# EasyEDA schematic Smart_Tiestu_v3.json
TITLE: Sheet_1; REV: 1.0; Date: 2025-11-17; Sheet: 1/1; Company: Your Company
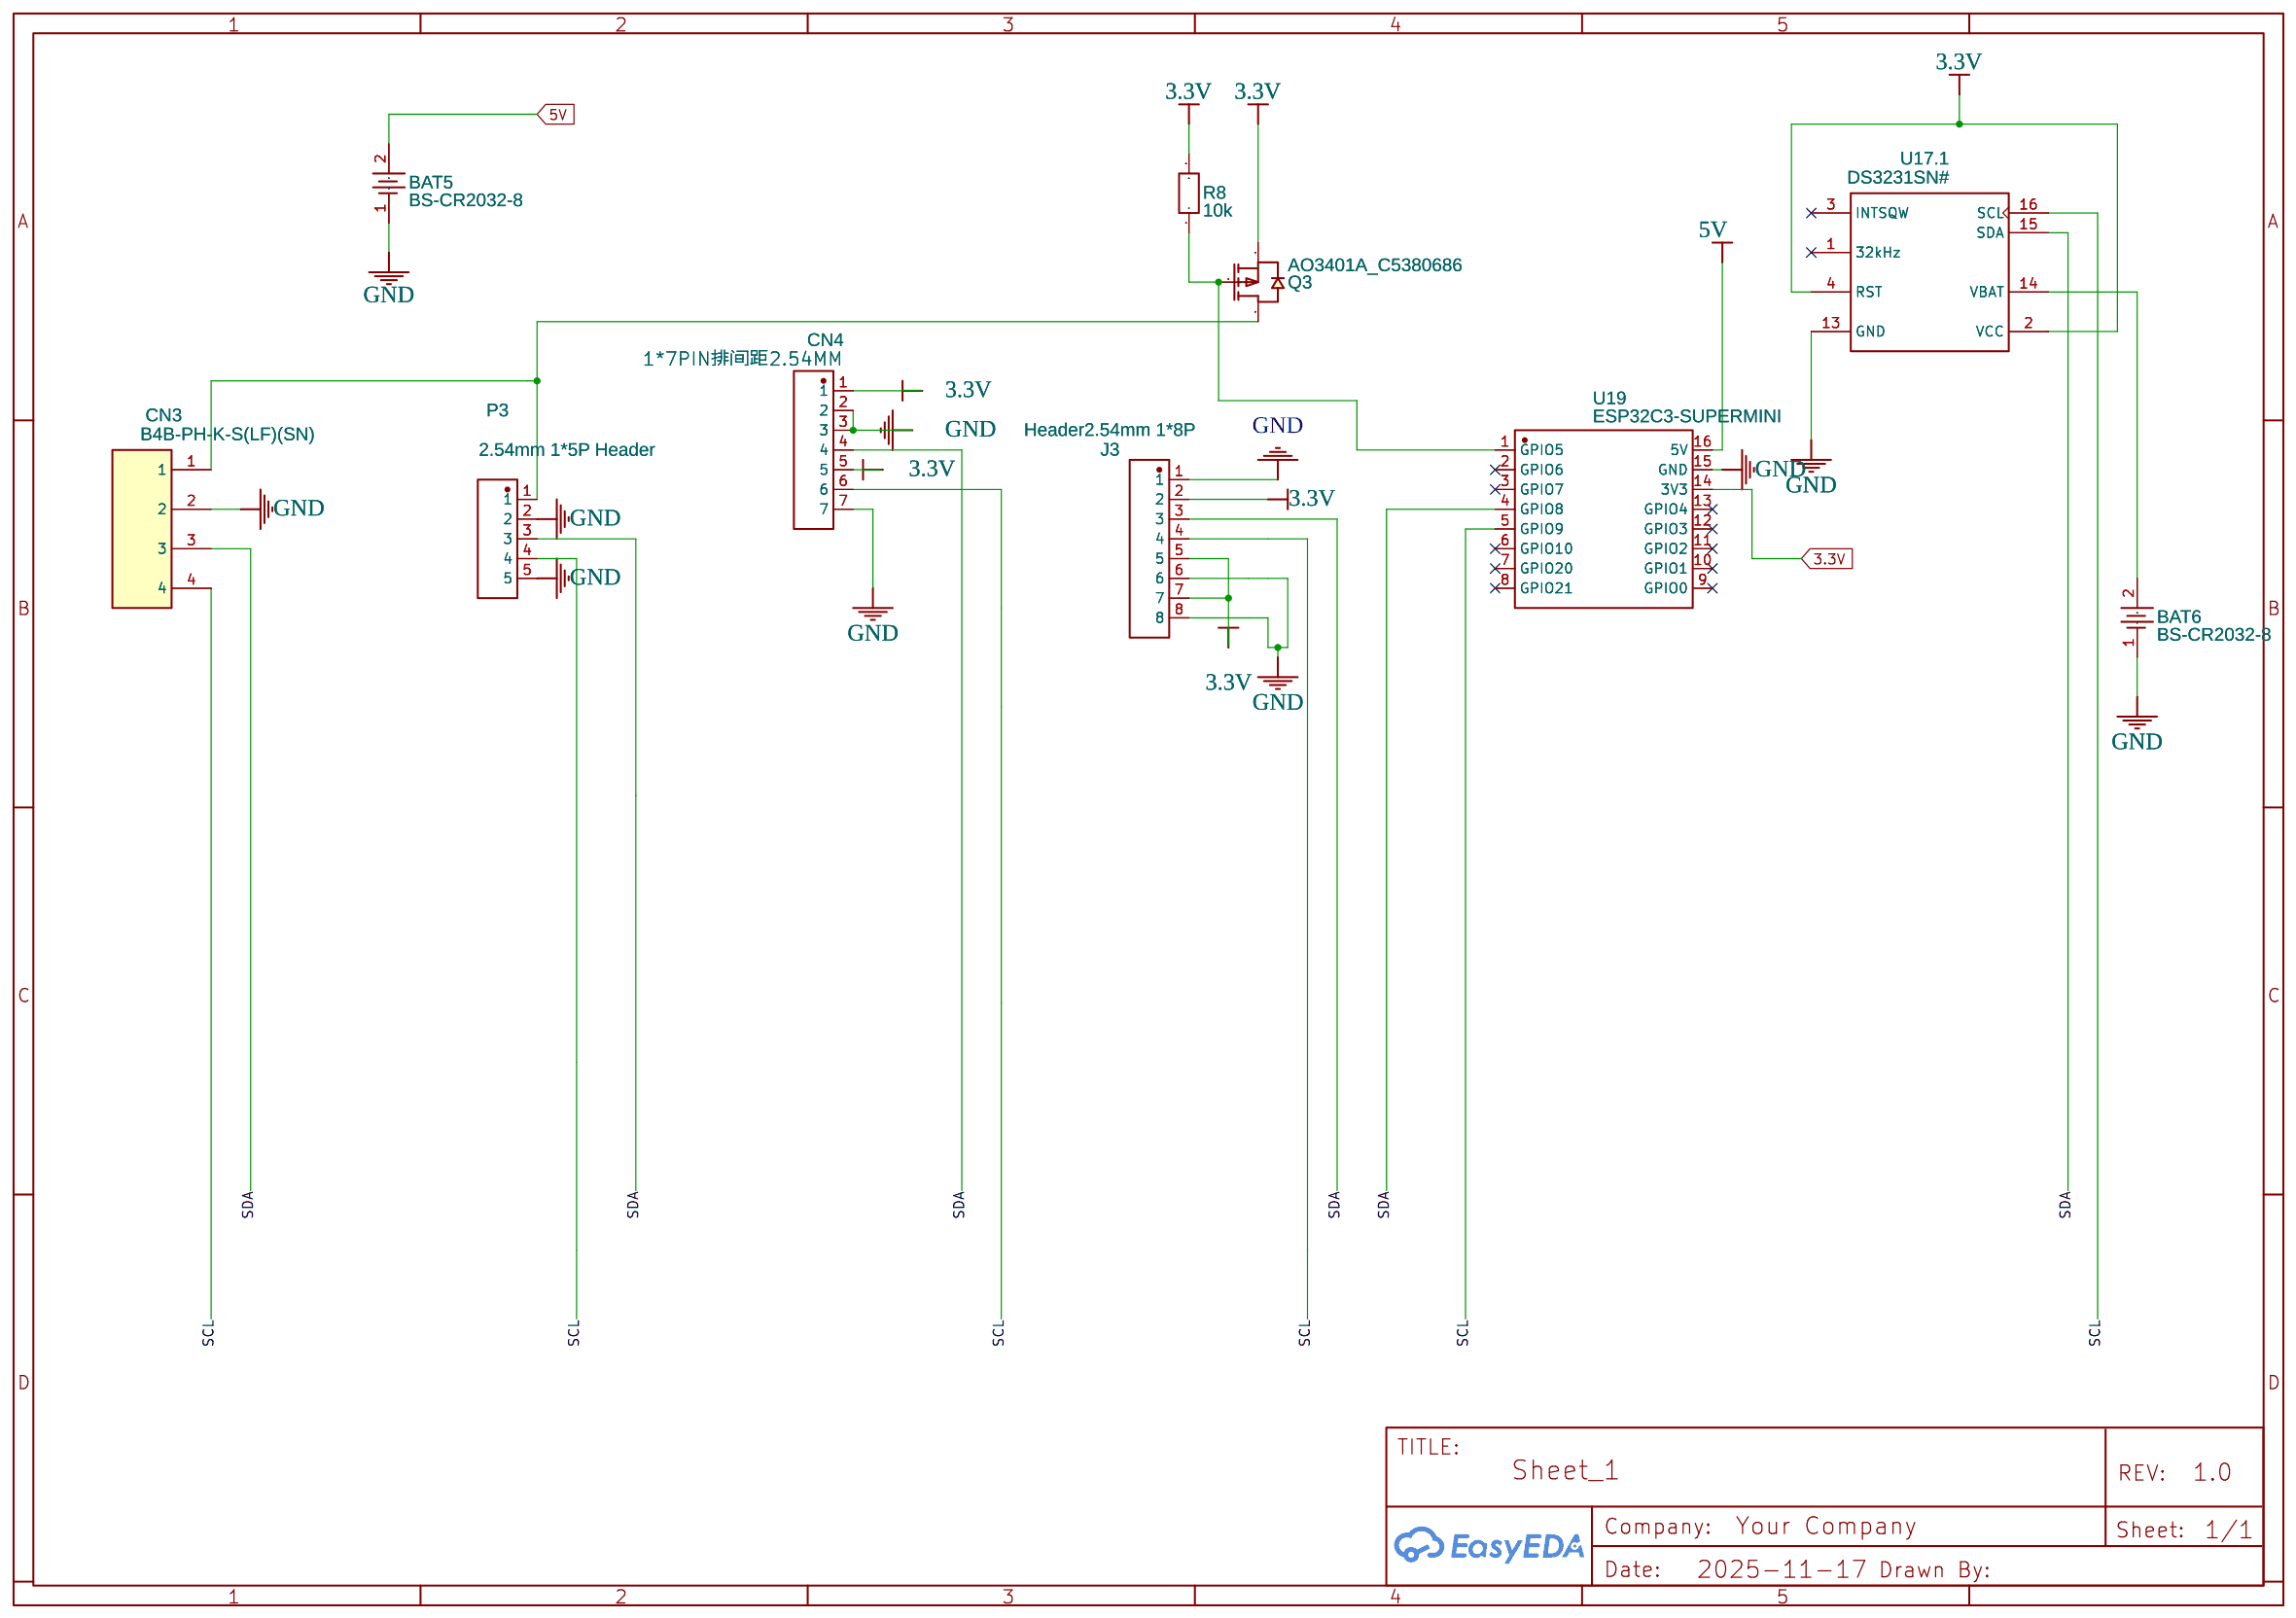
[diagram p0: schematic sheet]

## Parts
BAT5  BS-CR2032-8  [BAT-SMD_BS-CR2032-8]
BAT6  BS-CR2032-8  [BAT-SMD_BS-CR2032-8]
CN3  B4B-PH-K-S(LF)(SN)  [CONN-TH_B4B-PH-K-S]
CN4  1*7PIN排间距2.54MM  [CONN-TH_7P-P2.54_C9900012194]
J3  Header2.54mm 1*8P  [HDR-TH_8P-P2.54-V-M]
P3  2.54mm 1*5P Header  [HDR-TH_5P-P2.54-V-M]
Q3  AO3401A_C5380686  [SOT-23-3_L2.9-W1.3-P1.90-LS2.4-BR]
R8  10k  [R0603]
U17  DS3231SN#  [SOIC-16_L10.3-W7.5-P1.27-LS10.3-BL]  (section 1)
U19  ESP32C3-SUPERMINI  [COMM-SMD_16P-L22.5-W18.0-P2.54-TL]

## Library data of the parts
BAT5 BAT6 = BS-CR2032-8: Supplier: LCSC; Supplier Part: C7498149; Manufacturer: LX(连欣科技); Contributor: lcsc; JLCPCB Part Class: Extended Part
CN3 = B4B-PH-K-S(LF)(SN): Contributor: LCSC; Supplier: LCSC; Manufacturer: JST; Supplier Part: C131334; JLCPCB Part Class: Extended Part
CN4 = 1*7PIN排间距2.54MM: Contributor: LCSC; Supplier: LCSC; Supplier Part: C9900012194; Manufacturer: null; Manufacturer Part: 1*7pin排间距2.54mm; JLCPCB Part Class: Extended Part
J3 = Header2.54mm 1*8P: Supplier Part: C49256; Supplier: LCSC; Manufacturer: ReliaPro
P3 = 2.54mm 1*5P Header: Supplier Part: C50951; Supplier: LCSC; Manufacturer: ReliaPro
Q3 = AO3401A_C5380686: Contributor: lcsc; Supplier: LCSC; Supplier Part: C5380686; Manufacturer: FUXINSEMI(富芯森美); Manufacturer Part: AO3401A; JLCPCB Part Class: Extended Part
R8 = R_0603_EU: Contributor: LCEDA_Lib
U17 = DS3231SN#: tags: Clock; subpart_no: 1; image: http://image.lceda.cn/szlcsc/C9866.jpg; Supplier Part: C9866; Supplier: LCSC; Manufacturer: ADI(亚德诺)/MAXIM(美信); Manufacturer Part: DS3231SN#T&R; JLCPCB Part Class: Extended Part
U19 = ESP32C3-SUPERMINI: Supplier: LCSC; Supplier Part: C9900147397; Manufacturer: null; Manufacturer Part: ESP32C3-SuperMini; JLCPCB Part Class: Extended Part; Contributor: lcsc

## Nets
3.3V: CN4.1 CN4.5 J3.2 J3.5 J3.7 Q3.2(S) R8.2 U17.2(VCC) U17.4(RST) U19.14(3V3)
5V: BAT5.2 U19.16(5V)
GND: BAT5.1 BAT6.1 CN3.2 CN4.2 CN4.3 CN4.7 J3.1 J3.6 J3.8 P3.2 P3.5 U17.13(GND) U19.15(GND)
SCL: CN3.4 CN4.6 J3.4 P3.4 U17.16(SCL) U19.5(GPIO9)
SDA: CN3.3 CN4.4 J3.3 P3.3 U17.15(SDA) U19.4(GPIO8)
Net-(BAT6-2): BAT6.2 U17.14(VBAT)
Net-(CN3-1): CN3.1 P3.1 Q3.3(D)
Net-(Q3-1): Q3.1(G) R8.1 U19.1(GPIO5)

Not connected (* = marked no-connect by the designer): U17 1(32kHz)* 3(INTSQW)*; U19 2(GPIO6)* 3(GPIO7)* 6(GPIO10)* 7(GPIO20)* 8(GPIO21)* 9(GPIO0)* 10(GPIO1)* 11(GPIO2)* 12(GPIO3)* 13(GPIO4)*
